# Altium schematic sheet MCU1.SchDoc
size A3; SheetNumber: 6; SheetTotal: 6
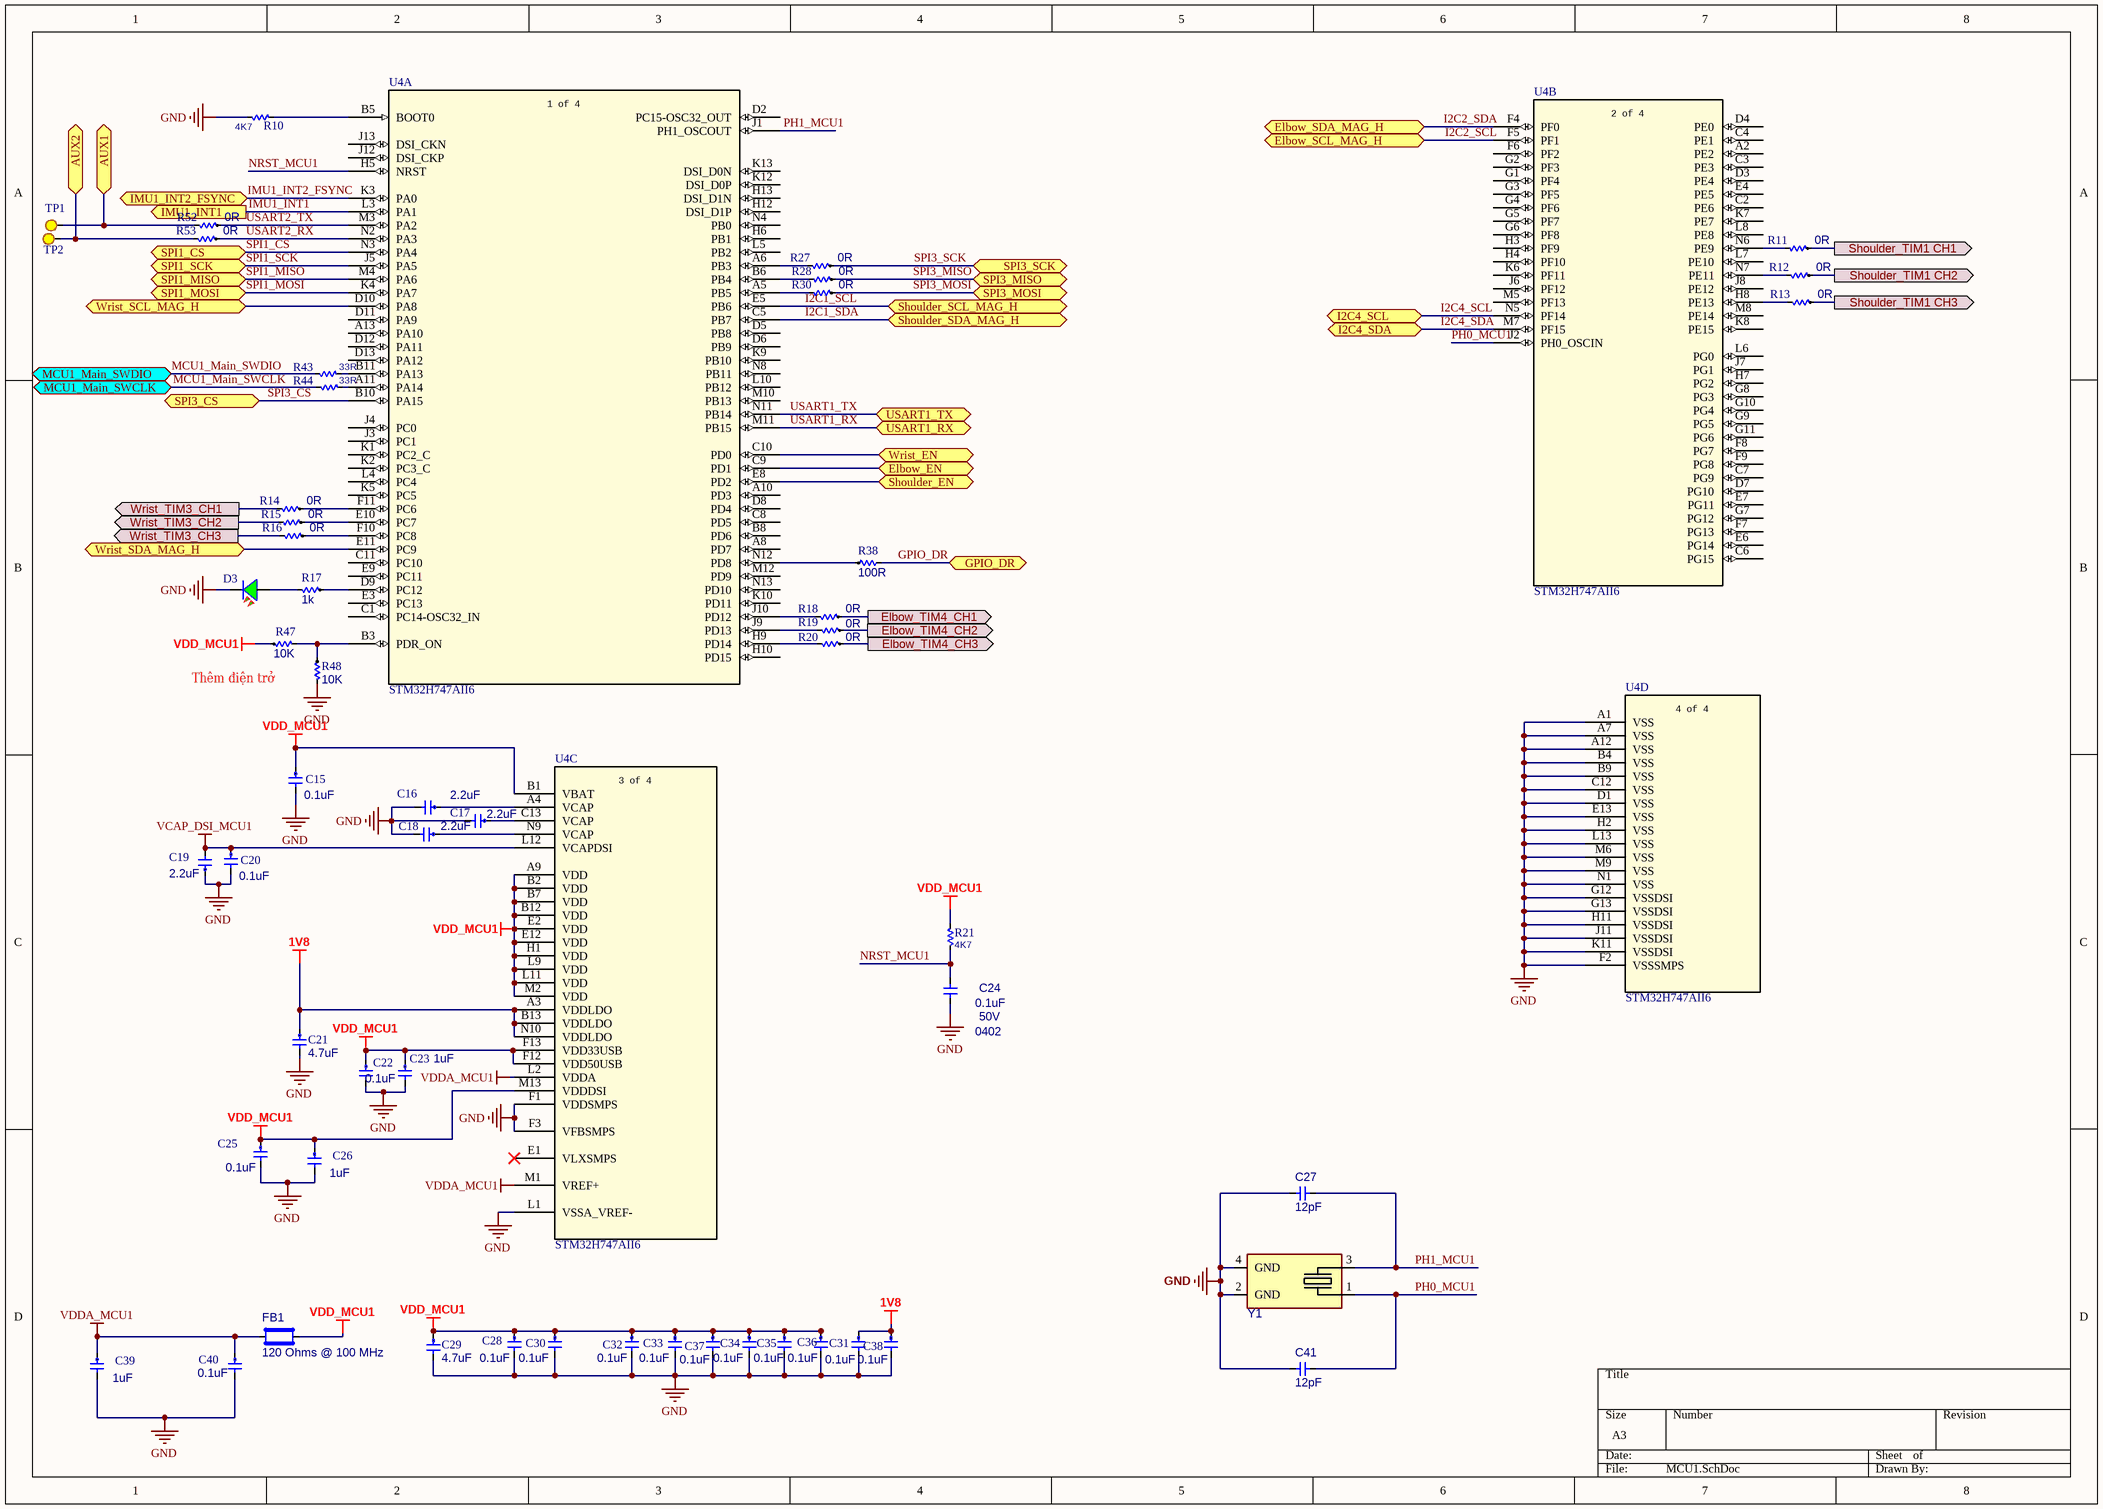
[diagram p0: MCU1.SchDoc]

## Parts
C15  value 0.1uF  [CAP0402]  (hidden comment: CAP0402 0.1uF 50V)
C16  value 2.2uF  [CAP0402]  (hidden comment: CAP0402 2.2uF 16V)
C17  value 2.2uF  [CAP0402]  (hidden comment: CAP0402 2.2uF 16V)
C18  value 2.2uF  [CAP0402]  (hidden comment: CAP0402 2.2uF 16V)
C19  value 2.2uF  [CAP0402]  (hidden comment: CAP0402 2.2uF 16V)
C20  value 0.1uF  [CAP0402]  (hidden comment: CAP0402 0.1uF 50V)
C21  value 4.7uF  [CAP0402]  (hidden comment: CAP0402 4.7uF 25V)
C22  value 1uF  [CAP0402]  (hidden comment: CAP0402 1uF 50V)
C23  value 0.1uF  [CAP0402]  (hidden comment: CAP0402 0.1uF 50V)
C24  value 0.1uF  Voltage: 50V  Package: 0402  [CAP0402]  (hidden comment: CAP0402 0.1uF 50V)
C25  value 0.1uF  [CAP0402]  (hidden comment: CAP0402 0.1uF 50V)
C26  value 1uF  [CAP0402]  (hidden comment: CAP0402 1uF 50V)
C27  value 12pF  [CAP0402]  (hidden comment: CAP0402 12pF 50V)
C28  value 0.1uF  [CAP0402]  (hidden comment: CAP0402 0.1uF 50V)
C29  value 4.7uF  [CAP0402]  (hidden comment: CAP0402 4.7uF 25V)
C30  value 0.1uF  [CAP0402]  (hidden comment: CAP0402 0.1uF 50V)
C31  value 0.1uF  [CAP0402]  (hidden comment: CAP0402 0.1uF 50V)
C32  value 0.1uF  [CAP0402]  (hidden comment: CAP0402 0.1uF 50V)
C33  value 0.1uF  [CAP0402]  (hidden comment: CAP0402 0.1uF 50V)
C34  value 0.1uF  [CAP0402]  (hidden comment: CAP0402 0.1uF 50V)
C35  value 0.1uF  [CAP0402]  (hidden comment: CAP0402 0.1uF 50V)
C36  value 0.1uF  [CAP0402]  (hidden comment: CAP0402 0.1uF 50V)
C37  value 0.1uF  [CAP0402]  (hidden comment: CAP0402 0.1uF 50V)
C38  value 0.1uF  [CAP0402]  (hidden comment: CAP0402 0.1uF 50V)
C39  value 1uF  [CAP0402]  (hidden comment: CAP0402 1uF 50V)
C40  value 0.1uF  [CAP0402]  (hidden comment: CAP0402 0.1uF 50V)
C41  value 12pF  [CAP0402]  (hidden comment: CAP0402 12pF 50V)
D3  SML-310MTT86  [LED0603 GREEN]  (value not drawn)
FB1  Impedance @ Frequency: 120 Ohms @ 100 MHz  [FERRIT0402]  (hidden comment: BLM15PX121SZ1D)
R10  value 4K7  [RES0402]  (hidden comment: RES0402 4K7)
R11  value 0R  [RES0402]  (hidden comment: RES0402 0R)
R12  value 0R  [RES0402]  (hidden comment: RES0402 0R)
R13  value 0R  [RES0402]  (hidden comment: RES0402 0R)
R14  value 0R  [RES0402]  (hidden comment: RES0402 0R)
R15  value 0R  [RES0402]  (hidden comment: RES0402 0R)
R16  value 0R  [RES0402]  (hidden comment: RES0402 0R)
R17  value 1k  [RES0402]  (hidden comment: RES0402 1K)
R18  value 0R  [RES0402]  (hidden comment: RES0402 0R)
R19  value 0R  [RES0402]  (hidden comment: RES0402 0R)
R20  value 0R  [RES0402]  (hidden comment: RES0402 0R)
R21  value 4K7  [RES0402]  (hidden comment: RES0402 4K7)
R27  value 0R  [RES0402]  (hidden comment: RES0402 0R)
R28  value 0R  [RES0402]  (hidden comment: RES0402 0R)
R30  value 0R  [RES0402]  (hidden comment: RES0402 0R)
R38  value 100R  [RES0402]  (hidden comment: RES0402 100R)
R43  value 33R  [RES0402]  (hidden comment: RES0402 33R)
R44  value 33R  [RES0402]  (hidden comment: RES0402 33R)
R47  value 10K  [RES0402]  (hidden comment: RES0402 10K)
R48  value 10K  [RES0402]  (hidden comment: RES0402 10K)
R52  value 0R  [RES0402]  (hidden comment: RES0402 0R)
R53  value 0R  [RES0402]  (hidden comment: RES0402 0R)
TP1  Test Point  [Test Point]  (value not drawn)  (no BOM)
TP2  Test Point  [Test Point]  (value not drawn)  (no BOM)
U4  STM32H747AII6  [UFBGA169]  (parts A,B,C,D of 4)
Y1  ECS-240-12-37B-CKY-TR  [XTAL_ECS-240-12-37B-CKY-TR]  (value not drawn)

## Ports
AUX1 (bidir), AUX2 (bidir), Elbow_EN (bidir), Elbow_SCL_MAG_H (bidir), Elbow_SDA_MAG_H (bidir), Elbow_TIM4_CH1 (out), Elbow_TIM4_CH2 (out), Elbow_TIM4_CH3 (out), GPIO_DR (bidir), I2C4_SCL (bidir), I2C4_SDA (bidir), IMU1_INT1 (out), IMU1_INT2_FSYNC (bidir), MCU1_Main_SWCLK (bidir), MCU1_Main_SWDIO (bidir), Shoulder_EN (bidir), Shoulder_SCL_MAG_H (bidir), Shoulder_SDA_MAG_H (bidir), Shoulder_TIM1 CH1 (out), Shoulder_TIM1 CH2 (out), Shoulder_TIM1 CH3 (out), SPI1_CS (bidir), SPI1_MISO (bidir), SPI1_MOSI (bidir), SPI1_SCK (bidir), SPI3_CS (bidir), SPI3_MISO (bidir), SPI3_MOSI (bidir), SPI3_SCK (bidir), USART1_RX (bidir), USART1_TX (bidir), Wrist_EN (bidir), Wrist_SCL_MAG_H (bidir), Wrist_SDA_MAG_H (bidir), Wrist_TIM3_CH1 (out), Wrist_TIM3_CH2 (out), Wrist_TIM3_CH3 (out)

## Nets
1V8: C21.1 C31.1 C38.1 U4.A3(VDDLDO) U4.B13(VDDLDO) U4.N10(VDDLDO)
GND: C15.2 C16.2 C17.2 C18.2 C19.1 C20.2 C21.2 C22.2 C23.2 C24.1 C25.2 C26.2 C27.2 C28.2 C29.2 C30.2 C31.2 C32.2 C33.2 C34.2 C35.2 C36.2 C37.2 C38.2 C39.2 C40.2 C41.2 D3.1 R10.1 R48.1 U4.A1(VSS) U4.A7(VSS) U4.A12(VSS) U4.B4(VSS) U4.B9(VSS) U4.C12(VSS) U4.D1(VSS) U4.E13(VSS) U4.F1(VDDSMPS) U4.F2(VSSSMPS) U4.F3(VFBSMPS) U4.G12(VSSDSI) U4.G13(VSSDSI) U4.H2(VSS) U4.H11(VSSDSI) U4.J11(VSSDSI) U4.K11(VSSDSI) U4.L1(VSSA_VREF-) U4.L13(VSS) U4.M6(VSS) U4.M9(VSS) U4.N1(VSS) Y1.2(GND) Y1.4(GND)
VCAP_DSI_MCU1: C19.2 C20.1 U4.L12(VCAPDSI)
VDD_MCU1: C15.1 C22.1 C23.1 C25.1 C26.1 C28.1 C29.1 C30.1 C32.1 C33.1 C34.1 C35.1 C36.1 C37.1 FB1.2 R21.2 R47.2 U4.A9(VDD) U4.B1(VBAT) U4.B2(VDD) U4.B7(VDD) U4.B12(VDD) U4.E2(VDD) U4.E12(VDD) U4.F12(VDD50USB) U4.F13(VDD33USB) U4.H1(VDD) U4.L9(VDD) U4.L11(VDD) U4.M2(VDD) U4.M13(VDDDSI)
VDDA_MCU1: C39.1 C40.1 FB1.1 U4.L2(VDDA) U4.M1(VREF+)
AUX1: R52.1 TP1.TP(Test_Point) ; port AUX1
AUX2: R53.1 TP2.TP(Test_Point) ; port AUX2
Elbow_EN: U4.C9(PD1) ; port Elbow_EN
Elbow_TIM4_CH1: R18.2 ; port Elbow_TIM4_CH1
Elbow_TIM4_CH2: R19.2 ; port Elbow_TIM4_CH2
Elbow_TIM4_CH3: R20.2 ; port Elbow_TIM4_CH3
GPIO_DR: R38.1 ; port GPIO_DR
I2C1_SCL: U4.E5(PB6) ; port Shoulder_SCL_MAG_H
I2C1_SDA: U4.C5(PB7) ; port Shoulder_SDA_MAG_H
I2C2_SCL: U4.F5(PF1) ; port Elbow_SCL_MAG_H
I2C2_SDA: U4.F4(PF0) ; port Elbow_SDA_MAG_H
I2C4_SCL: U4.N5(PF14) ; port I2C4_SCL
I2C4_SDA: U4.M7(PF15) ; port I2C4_SDA
IMU1_INT1: U4.L3(PA1) ; port IMU1_INT1
IMU1_INT2_FSYNC: U4.K3(PA0) ; port IMU1_INT2_FSYNC
MCU1_Main_SWCLK: R44.1 ; port MCU1_Main_SWCLK
MCU1_Main_SWDIO: R43.1 ; port MCU1_Main_SWDIO
NRST_MCU1: C24.2 R21.1 U4.H5(NRST)
PH0_MCU1: C41.1 U4.J2(PH0_OSCIN) Y1.1(IO)
PH1_MCU1: C27.1 U4.J1(PH1_OSCOUT) Y1.3(IO)
Shoulder_EN: U4.E8(PD2) ; port Shoulder_EN
Shoulder_TIM1 CH1: R11.2 ; port Shoulder_TIM1 CH1
Shoulder_TIM1 CH2: R12.2 ; port Shoulder_TIM1 CH2
Shoulder_TIM1 CH3: R13.2 ; port Shoulder_TIM1 CH3
SPI1_CS: U4.N3(PA4) ; port SPI1_CS
SPI1_MISO: U4.M4(PA6) ; port SPI1_MISO
SPI1_MOSI: U4.K4(PA7) ; port SPI1_MOSI
SPI1_SCK: U4.J5(PA5) ; port SPI1_SCK
SPI3_CS: U4.B10(PA15) ; port SPI3_CS
SPI3_MISO: R28.2 ; port SPI3_MISO
SPI3_MOSI: R30.2 ; port SPI3_MOSI
SPI3_SCK: R27.2 ; port SPI3_SCK
USART1_RX: U4.M11(PB15) ; port USART1_RX
USART1_TX: U4.N11(PB14) ; port USART1_TX
USART2_RX: R53.2 U4.N2(PA3)
USART2_TX: R52.2 U4.M3(PA2)
Wrist_EN: U4.C10(PD0) ; port Wrist_EN
Wrist_SCL_MAG_H: U4.D10(PA8) ; port Wrist_SCL_MAG_H
Wrist_SDA_MAG_H: U4.E11(PC9) ; port Wrist_SDA_MAG_H
Wrist_TIM3_CH1: R14.1 ; port Wrist_TIM3_CH1
Wrist_TIM3_CH2: R15.1 ; port Wrist_TIM3_CH2
Wrist_TIM3_CH3: R16.1 ; port Wrist_TIM3_CH3
NetC16_1: C16.1 U4.A4(VCAP)
NetC17_1: C17.1 U4.C13(VCAP)
NetC18_1: C18.1 U4.N9(VCAP)
NetD3_2: D3.2 R17.1
NetR10_2: R10.2 U4.B5(BOOT0)
NetR11_1: R11.1 U4.N6(PE9)
NetR12_1: R12.1 U4.N7(PE11)
NetR13_1: R13.1 U4.H8(PE13)
NetR14_2: R14.2 U4.F11(PC6)
NetR15_2: R15.2 U4.E10(PC7)
NetR16_2: R16.2 U4.F10(PC8)
NetR17_2: R17.2 U4.D9(PC12)
NetR18_1: R18.1 U4.J10(PD12)
NetR19_1: R19.1 U4.J9(PD13)
NetR20_1: R20.1 U4.H9(PD14)
NetR27_1: R27.1 U4.A6(PB3)
NetR28_1: R28.1 U4.B6(PB4)
NetR30_1: R30.1 U4.A5(PB5)
NetR38_2: R38.2 U4.N12(PD8)
NetR43_2: R43.2 U4.B11(PA13)
NetR44_2: R44.2 U4.A11(PA14)
NetR47_1: R47.1 R48.2 U4.B3(PDR_ON)

Not connected (* = marked no-connect by the designer): U4 A2(PE2) A8(PD7) A10(PD3) A13(PA10) B8(PD6) C1(PC14-OSC32_IN) C2(PE6) C3(PE3) C4(PE1) C6(PG15) C7(PG9) C8(PD5) C11(PC10) D2(PC15-OSC32_OUT) D3(PE4) D4(PE0) D5(PB8) D6(PB9) D7(PG10) D8(PD4) D11(PA9) D12(PA11) D13(PA12) E1(VLXSMPS)* E3(PC13) E4(PE5) E6(PG14) E7(PG11) E9(PC11) F6(PF2) F7(PG13) F8(PG7) F9(PG8) G1(PF4) G2(PF3) G3(PF5) G4(PF6) G5(PF7) G6(PF8) G7(PG12) G8(PG3) G9(PG5) G10(PG4) G11(PG6) H3(PF9) H4(PF10) H6(PB1) H7(PG2) H10(PD15) H12(DSI_D1P) H13(DSI_D1N) J3(PC1) J4(PC0) J6(PF12) J7(PG1) J8(PE12) J12(DSI_CKP) J13(DSI_CKN) K1(PC2_C) K2(PC3_C) K5(PC5) K6(PF11) K7(PE7) K8(PE15) K9(PB10) K10(PD11) K12(DSI_D0P) K13(DSI_D0N) L4(PC4) L5(PB2) L6(PG0) L7(PE10) L8(PE8) L10(PB12) M5(PF13) M8(PE14) M10(PB13) M12(PD9) N4(PB0) N8(PB11) N13(PD10)

## Notes on the sheet
- Thêm điện trở
- (in symbol STM32H747AII6, part A) 1 of 4
- (in symbol STM32H747AII6, part B) 2 of 4
- (in symbol STM32H747AII6, part C) 3 of 4
- (in symbol STM32H747AII6, part D) 4 of 4

## Library data of the parts
C15 C20 C23 C25 C28 C30-C38 C40 = CAP0402 0.1uF 50V: Cap 0.1uF 50V 0402; MP: CC0402KRX5R9BB104; Tolerance: 10%; Voltage: 50V; Package: 0402
C16-C19 = CAP0402 2.2uF 16V: Cap 2.2uF 16V 0402; MP: C1005X5R1C225K050BC; Voltage: 16V; Package: 0402
C21 C29 = CAP0402 4.7uF 25V: Cap 4.7uF 25V 0402; MP: GRM155C61E475ME15J; Tolerance: 20%; Voltage: 25V; Package: 0402
C22 C26 C39 = CAP0402 1uF 50V: Cap 1uF 50V 0402; MP: GRM155R61H105KE05D; Voltage - Rate: 50V; Package: 0402
C24 = CAP0402 0.1uF 50V: Cap 0.1uF 50V 0402; MP: CC0402KRX5R9BB104
C27 C41 = CAP0402 12pF 50V: Cap 12pF 50V 0402
D3 = CMP-01130-2: LED GREEN CLEAR 0603 SMD; Manufacturer 1: Rohm Semiconductor; Luminous Intensity: 16mcd; Wavelength: 570nm; Number of LEDs: 1; Color: Green,Yellow; Forward Voltage: 2.2V; Lens Color: Colorless,Clear; Forward Current: 20mA; Viewing Angle: 140°; Lens Style: Rectangular,Clear,Diffused,Colorless; Case Code (Imperial): 0603; Lens Transparency: Clear; Package Quantity: 3000; Width: 0.8mm; Manufacturer Part Number 1: SML-310MTT86; Min Operating Temperature: -30°C; Length: 1.6mm; Packaging: Tape and Reel; Dominant Wavelength: 570nm; Height: 0.9mm; Radiation Hardening: No; Test Current: 20mA; Case Code (Metric): 1608; Lead Free: Lead Free; Case/Package: 0603; Mount: Surface Mount; Max Operating Temperature: 85°C; Illumination Color: Green; Number of Pins: 2
FB1 = BLM15PX121SZ1D: 120 Ohms @ 100 MHz 1 Power Line Ferrite Bead 0402 (1005 Metric) 2A 55mOhm; MP: BLM15PX121SZ1D; Current Rating (Max): 2A; DC Resistance (DCR) (Max): 55mOhm
R10 R21 = RES0402 4K7: RES 4K7 0402; MP: RC0402JR-074K7L
R11-R16 R18-R20 R27 R28 R30 R52 R53 = RES0402 0R: RES 0R 0402; MP: RC0402JR-070RL; Power Rating: 63mW; Tolerance: 5%; Package: 0402
R17 = RES0402 1K: RES 1K 0402; MP: RC0402FR-071KL; Tolerance: 1%; Power rating: 63mW; Package: 0402
R38 = RES0402 100R: RES 100R 0402; MP: RC0402FR-07100RL
R43 R44 = RES0402 33R: RES 33R 0402; MP: RC0402FR-0733RL
R47 R48 = RES0402 10K: RES 10K 0402; MP: RC0402FR-0710KL; Power rating: 63mW; Tolerance: 1%; Package: 0402
U4 = STM32H747AII6: High-performance and DSP with DP-FPU, Arm Cortex-M7 + Cortex-M4 MCU with 2MBytes of Flash memory, 1MB RAM, 480 MHz CPU, Art Accelerator, L1 cache, external memory interface, large set of peripherals, SMPS, MIPI-DSI; Manufacturer_Name: STMicroelectronics; Copyright: Copyright (C) 2026 Ultra Librarian. All rights reserved.; Manufacturer_Part_Number: STM32H747AII6; RefDes: RefDes; Type: Type
Y1 = ECS-240-12-37B-CKY-TR: Crystal 24 MHz ±10ppm 12pF 50 Ohms 4-SMD, No Lead; Frequency: 24 MHz; ESR (Equivalent Series Resistance): 50 Ohms; MP: ECS-240-12-37B-CKY-TR; Frequency Stability: ±10ppm; Frequency Tolerance: ±10ppm; Load Capacitance: 12pF; Operating Temperature: -30°C ~ 85°C; Size / Dimension: 2.00mm x 1.60mm